# EAGLE schematic b0_frame (EAGLE 6.4)
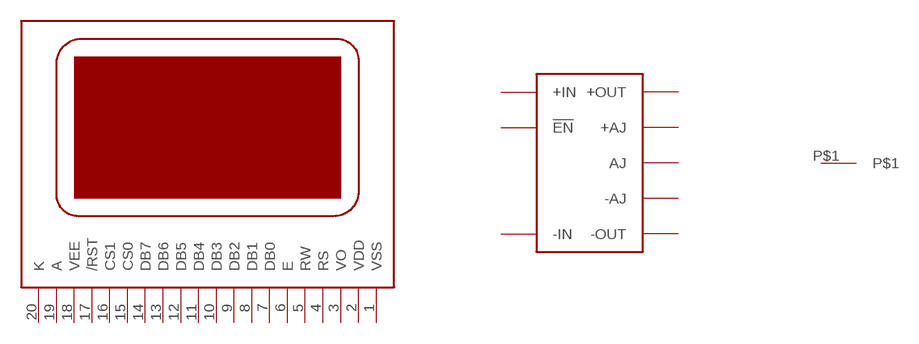
[diagram p0: schematic, sheet 1]

## Parts
U$1  12864B  [12864B]
U$2  HPH-12/30-D48  [CASE_C61]
U$3  РША14  [РША]
Unconnected: U$1.1(VSS) U$1.2(VDD) U$1.3(VO) U$1.4(RS) U$1.5(RW) U$1.6(E) U$1.7(DB0) U$1.8(DB1) U$1.9(DB2) U$1.10(DB3) U$1.11(DB4) U$1.12(DB5) U$1.13(DB6) U$1.14(DB7) U$1.15(CS0) U$1.16(CS1) U$1.17(/RST) U$1.18(VEE) U$1.19(A) U$1.20(K) U$2.!EN U$2.+AJ U$2.+IN U$2.+OUT U$2.-AJ U$2.-IN U$2.-OUT U$2.AJ U$3.P$1

## Library data of the parts
U$1 = b0:12864B: KS0108 based display. Some have slightly different pinouts so double check!
U$2 = b0:HPH-12/30-D48
U$3 = b0:РША14